# Altium project ETRX_Shield.PrjPcb (part 2 of 2)

## Sheet [2] MCU.SchDoc
size A4; DocumentNumber: 3; SheetNumber: 3; SheetTotal: 4
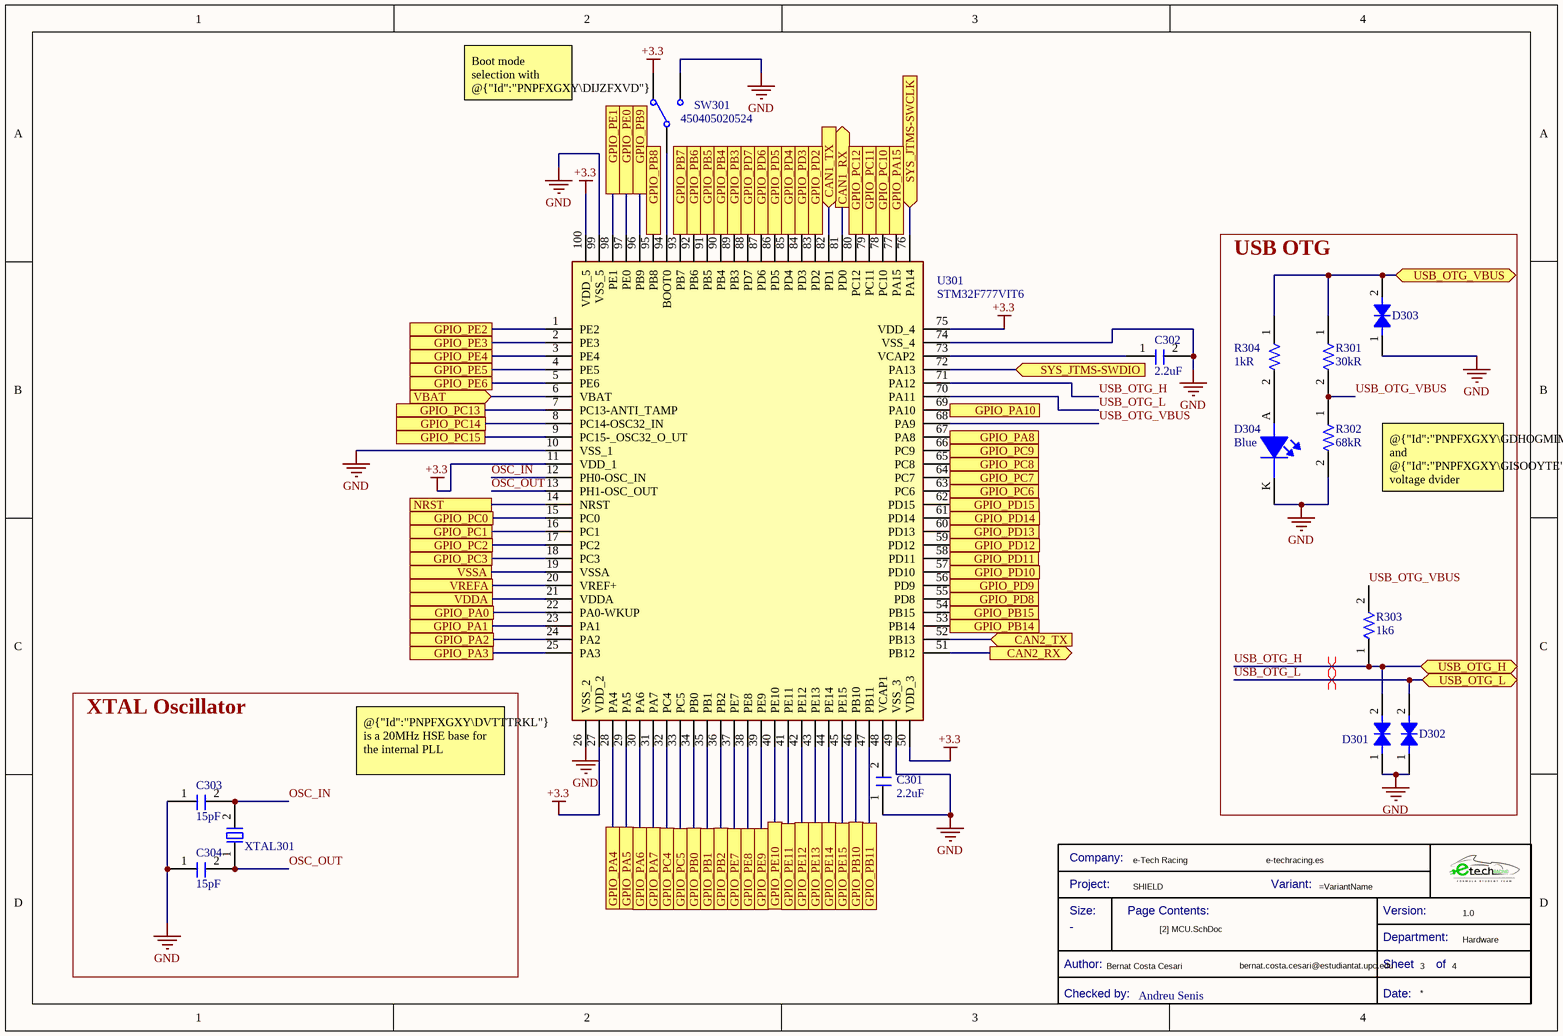
[diagram p2: [2] MCU.SchDoc]

### Parts
(Parts that share a designator on the sheet are numbered #1, #2 ... from top to bottom, then left to right.)
*?#2  Checked by:: Andreu Senis  (hidden comment: Title Block_template)  (graphical)
C301  Capacitance: 2.2uF  [C2.2u-100V-1812MLCC-X7R]  (hidden comment: HMK432B7225KM-T)
C302  Capacitance: 2.2uF  [C2.2u-100V-1812MLCC-X7R]  (hidden comment: HMK432B7225KM-T)
C303  Capacitance: 15pF  [C0805FNPC-R]  (hidden comment: 885012007052)
C304  Capacitance: 15pF  [C0805FNPC-R]  (hidden comment: 885012007052)
D301  824551301  [DTVS-DO-214AB]  (value not drawn)
D302  824551301  [DTVS-DO-214AB]  (value not drawn)
D303  824551301  [DTVS-DO-214AB]  (value not drawn)
D304  Color: Blue  [LED_0805_WE]  (hidden comment: 150080BS75000)
R301  Resistance: 30kR  [R1206FTK-W]  (hidden comment: CRCW120630K0FKEA)
R302  Resistance: 68kR  [R1206FTK-W]  (hidden comment: CR1206AFX-6802EAS)
R303  Resistance: 1k6  [R1206FTK-W]  (hidden comment: CRCW12061K60FKEA)
R304  Resistance: 1kR  [R0805FTK]  (hidden comment: CR0805-JW-102ELF)
SW301  450405020524  [450405020524]
U301  STM32F777VIT6  [QFP50P1600X1600X160-100N]
XTAL301  830028710  [XTAL20M_SMD]  (value not drawn)

### Blocks framed on the sheet
USB OTG: D301-D304 R301-R304
XTAL Oscillator: C303 C304 XTAL301

### Ports
CAN1_RX (out), CAN1_TX (in), CAN2_RX (out), CAN2_TX (in), GPIO_PA0, GPIO_PA1, GPIO_PA2, GPIO_PA3, GPIO_PA4, GPIO_PA5, GPIO_PA6, GPIO_PA7, GPIO_PA8, GPIO_PA10, GPIO_PA15, GPIO_PB0, GPIO_PB1, GPIO_PB2, GPIO_PB3, GPIO_PB4, GPIO_PB5, GPIO_PB6, GPIO_PB7, GPIO_PB8, GPIO_PB9, GPIO_PB10, GPIO_PB11, GPIO_PB14, GPIO_PB15, GPIO_PC0, GPIO_PC1, GPIO_PC2, GPIO_PC3, GPIO_PC4, GPIO_PC5, GPIO_PC6, GPIO_PC7, GPIO_PC8, GPIO_PC9, GPIO_PC10, GPIO_PC11, GPIO_PC12, GPIO_PC13, GPIO_PC14, GPIO_PC15, GPIO_PD2, GPIO_PD3, GPIO_PD4, GPIO_PD5, GPIO_PD6, GPIO_PD7, GPIO_PD8, GPIO_PD9, GPIO_PD10, GPIO_PD11, GPIO_PD12, GPIO_PD13, GPIO_PD14, GPIO_PD15, GPIO_PE0, GPIO_PE1, GPIO_PE2, GPIO_PE3, GPIO_PE4, GPIO_PE5, GPIO_PE6, GPIO_PE7, GPIO_PE8, GPIO_PE9, GPIO_PE10, GPIO_PE11, GPIO_PE12, GPIO_PE13, GPIO_PE14, GPIO_PE15, NRST, SYS_JTMS-SWCLK (in), SYS_JTMS-SWDIO (in), USB_OTG_H (bidir), USB_OTG_L (bidir), USB_OTG_VBUS (bidir), VBAT (in), VDDA, VREFA, VSSA

### Nets
+3.3: SW301.L1 U301.11(VDD_1) U301.27(VDD_2) U301.50(VDD_3) U301.75(VDD_4) U301.100(VDD_5)
GND: C301.1 C302.2 C303.1 C304.1 D301.1 D302.1 D303.1 D304.K R302.2 SW301.L2 U301.10(VSS_1) U301.26(VSS_2) U301.49(VSS_3) U301.74(VSS_4) U301.99(VSS_5)
CAN1_RX: U301.81(PD0) ; port CAN1_RX
CAN1_TX: U301.82(PD1) ; port CAN1_TX
CAN2_RX: U301.51(PB12) ; port CAN2_RX
CAN2_TX: U301.52(PB13) ; port CAN2_TX
NRST: U301.14(NRST) ; port NRST
OSC_IN: C303.2 U301.12(PH0-OSC_IN) XTAL301.2
OSC_OUT: C304.2 U301.13(PH1-OSC_OUT) XTAL301.1
PA0: U301.22(PA0-WKUP) ; port GPIO_PA0
PA1: U301.23(PA1) ; port GPIO_PA1
PA2: U301.24(PA2) ; port GPIO_PA2
PA3: U301.25(PA3) ; port GPIO_PA3
PA4: U301.28(PA4) ; port GPIO_PA4
PA5: U301.29(PA5) ; port GPIO_PA5
PA6: U301.30(PA6) ; port GPIO_PA6
PA7: U301.31(PA7) ; port GPIO_PA7
PA8: U301.67(PA8) ; port GPIO_PA8
PA10: U301.69(PA10) ; port GPIO_PA10
PA15: U301.77(PA15) ; port GPIO_PA15
PB0: U301.34(PB0) ; port GPIO_PB0
PB1: U301.35(PB1) ; port GPIO_PB1
PB2: U301.36(PB2) ; port GPIO_PB2
PB3: U301.89(PB3) ; port GPIO_PB3
PB4: U301.90(PB4) ; port GPIO_PB4
PB5: U301.91(PB5) ; port GPIO_PB5
PB6: U301.92(PB6) ; port GPIO_PB6
PB7: U301.93(PB7) ; port GPIO_PB7
PB8: U301.95(PB8) ; port GPIO_PB8
PB9: U301.96(PB9) ; port GPIO_PB9
PB10: U301.46(PB10) ; port GPIO_PB10
PB11: U301.47(PB11) ; port GPIO_PB11
PB14: U301.53(PB14) ; port GPIO_PB14
PB15: U301.54(PB15) ; port GPIO_PB15
PC0: U301.15(PC0) ; port GPIO_PC0
PC1: U301.16(PC1) ; port GPIO_PC1
PC2: U301.17(PC2) ; port GPIO_PC2
PC3: U301.18(PC3) ; port GPIO_PC3
PC4: U301.32(PC4) ; port GPIO_PC4
PC5: U301.33(PC5) ; port GPIO_PC5
PC6: U301.63(PC6) ; port GPIO_PC6
PC7: U301.64(PC7) ; port GPIO_PC7
PC8: U301.65(PC8) ; port GPIO_PC8
PC9: U301.66(PC9) ; port GPIO_PC9
PC11: U301.79(PC11) ; port GPIO_PC11
PC12: U301.80(PC12) ; port GPIO_PC12
PC13: U301.7(PC13-ANTI_TAMP) ; port GPIO_PC13
PC14: U301.8(PC14-OSC32_IN) ; port GPIO_PC14
PC15: U301.9(PC15-_OSC32_O_UT) ; port GPIO_PC15
PD2: U301.83(PD2) ; port GPIO_PD2
PD3: U301.84(PD3) ; port GPIO_PD3
PD4: U301.85(PD4) ; port GPIO_PD4
PD5: U301.86(PD5) ; port GPIO_PD5
PD6: U301.87(PD6) ; port GPIO_PD6
PD7: U301.88(PD7) ; port GPIO_PD7
PD8: U301.55(PD8) ; port GPIO_PD8
PD9: U301.56(PD9) ; port GPIO_PD9
PD10: U301.57(PD10) U301.78(PC10) ; port GPIO_PD10, port GPIO_PC10
PD11: U301.58(PD11) ; port GPIO_PD11
PD12: U301.59(PD12) ; port GPIO_PD12
PD13: U301.60(PD13) ; port GPIO_PD13
PD14: U301.61(PD14) ; port GPIO_PD14
PD15: U301.62(PD15) ; port GPIO_PD15
PE0: U301.97(PE0) ; port GPIO_PE0
PE1: U301.98(PE1) ; port GPIO_PE1
PE2: U301.1(PE2) ; port GPIO_PE2
PE3: U301.2(PE3) ; port GPIO_PE3
PE4: U301.3(PE4) ; port GPIO_PE4
PE5: U301.4(PE5) ; port GPIO_PE5
PE6: U301.5(PE6) ; port GPIO_PE6
PE7: U301.37(PE7) ; port GPIO_PE7
PE8: U301.38(PE8) ; port GPIO_PE8
PE9: U301.39(PE9) ; port GPIO_PE9
PE10: U301.40(PE10) ; port GPIO_PE10
PE11: U301.41(PE11) ; port GPIO_PE11
PE12: U301.42(PE12) ; port GPIO_PE12
PE13: U301.43(PE13) ; port GPIO_PE13
PE14: U301.44(PE14) ; port GPIO_PE14
PE15: U301.45(PE15) ; port GPIO_PE15
SYS_JTMS-SWCLK: U301.76(PA14) ; port SYS_JTMS-SWCLK
SYS_JTMS-SWDIO: U301.72(PA13) ; port SYS_JTMS-SWDIO
USB_OTG_H: D301.2 R303.1 U301.71(PA12) ; port USB_OTG_H
USB_OTG_L: D302.2 U301.70(PA11) ; port USB_OTG_L
USB_OTG_VBUS: R301.2 R302.1 R303.2 U301.68(PA9)
USB_VBUS: D303.2 R301.1 R304.1 ; port USB_OTG_VBUS
VBAT: U301.6(VBAT) ; port VBAT
VDDA: U301.21(VDDA) ; port VDDA
VREFA: U301.20(VREF+) ; port VREFA
VSSA: U301.19(VSSA) ; port VSSA
NetC301_2: C301.2 U301.48(VCAP1)
NetC302_1: C302.1 U301.73(VCAP2)
NetD304_A: D304.A R304.2
NetSW301_COM: SW301.COM U301.94(BOOT0)

### Layout directives
differential pair: USB_OTG_H, USB_OTG_L

### Notes on the sheet
- Boot mode selection with @{"Id":"PNPFXGXY\DIJZFXVD"}
- @{"Id":"PNPFXGXY\GDHOGMIM"} and @{"Id":"PNPFXGXY\GISOOYTE"} voltage dvider required to match AMR
- @{"Id":"PNPFXGXY\DVTTTRKL"} is a 20MHz HSE base for the internal PLL
- (in symbol Title Block_template) Company:; Project:; Variant:; Size:; Page Contents:; Version:; Department:; Author:; Sheet; of; Checked by:; Date:

### Library data of the parts
*?#2 = Title Block_template: Standard Title Block; .Creator: GP; Category: Title Block; .PCBcheck: GP; .SCHcheck: GP; Size: -
C301 C302 = C2.2u-100V-1812MLCC-X7R: 贴片陶瓷电容 2.2uF ±10% 100V X7R 1812; Manufacturer: Taiyo Yuden; .Creator: DO; Manufacturer Part Number: HMK432B7225KM-T; RoHS: Yes; Category: Ceramic Capacitors; Stock 1: 13000; Pricing 1: 500=0,58000, 1000=0,47500, 1500=0,47000, 2000=0,46500 (USD); Mount: Surface Mount; Case/Package: 1812; Number of Pins: 2; Case Code (Metric): 4532; Case Code (Imperial): 1812; Min Operating Temperature: -55°C; Max Operating Temperature: 125°C; Package Quantity: 1; Voltage Rating: 100V; Tolerance: 10%; Packaging: Tape and Reel; Voltage Rating (DC): 100V; Dielectric: X7R; Termination: SMD/SMT; Series: M; Construction: Flat; Resistor Type: Ceramic; Length: 4.5mm; Width: 0.126inch; Height: 2.5mm; Thickness: 0.106inch; Depth: 3.2mm; Radiation Hardening: No; RoHS Compliant: Yes; REACH SVHC: Unknown; Halogen Free: Halogen Free; ComponentLink1URL: https://datasheet.ciiva.com/142/hmk432b7225km-t-ss-142288.pdf?src-supplier=Digi-Key; ComponentLink1Description: https://datasheet.ciiva.com/142/hmk432b7225km-t-ss-142288.pdf?src-supplier=Digi-Key; ComponentLink2URL: https://datasheet.ciiva.com/26871/getdatasheetpartid-638888-26871989.pdf?src-supplier=Verical; ComponentLink2Description: https://datasheet.ciiva.com/26871/getdatasheetpartid-638888-26871989.pdf?src-supplier=Verical; ComponentLink3URL: https://datasheet.ciiva.com/30247/946hmk432b7225km-t-30247370.pdf?src-supplier=Onlinecomponents.com; ComponentLink3Description: https://datasheet.ciiva.com/30247/946hmk432b7225km-t-30247370.pdf?src-supplier=Onlinecomponents.com; ComponentLink4URL: https://datasheet.ciiva.com/28645/746258-28645086.pdf?src-supplier=Element14; ComponentLink4Description: https://datasheet.ciiva.com/28645/746258-28645086.pdf?src-supplier=Element14; ComponentLink5URL: https://datasheet.ciiva.com/15921/mlcc06-e-15921031.pdf?src-supplier=Onlinecomponents.com; ComponentLink5Description: https://datasheet.ciiva.com/15921/mlcc06-e-15921031.pdf?src-supplier=Onlinecomponents.com; Supplier Part Number 1: 9062137; Supplier 1: Future Electronics
C303 C304 = C15p-50V-0805FNPC-NP0: Cap, 15PF, 50V, 5%, C0G/NP0, 0805; Manufacturer 1: Wurth Electronics; .Creator: DR; Supplier 1: Newark; Manufacturer Part Number 1: 885012007052; RoHS: Yes; Category: Ceramic Capacitors; Stock 1: 815; Pricing 1: 1=0,10800, 10=0,05200, 25=0,05100, 50=0,04900, 100=0,04800, 250=0,04600, 500=0,04300 (USD); Mount: Surface Mount; Case/Package: 0805; Case Code (Metric): 2012; Case Code (Imperial): 0805; Min Operating Temperature: -55°C; Max Operating Temperature: 125°C; Packaging: Cut Tape; Voltage Rating: 50V; Tolerance: 5%; Length: 0.079inch; Width: 0.049inch; Thickness: 0.028inch; RoHS Compliant: Yes; ComponentLink1URL: http://www.farnell.com/datasheets/2031702.pdf?src-supplier=Farnell; ComponentLink1Description: http://www.farnell.com/datasheets/2031702.pdf?src-supplier=Farnell; ComponentLink2URL: http://katalog.we-online.de/pbs/datasheet/885012007052.pdf?src-supplier=Digi-Key; ComponentLink2Description: http://katalog.we-online.de/pbs/datasheet/885012007052.pdf?src-supplier=Digi-Key; ComponentLink3URL: https://katalog.we-online.de/pbs/datasheet/885012007052.pdf?src-supplier=Digi-Key; ComponentLink3Description: https://katalog.we-online.de/pbs/datasheet/885012007052.pdf?src-supplier=Digi-Key; Supplier Part Number 1: 15AC9316
D301-D303 = DTVS-40V-DO-214AB: TVS diode [Würth Elektronik] 824551301 TVS diode; Manufacturer: Wurth Electronics; Number of Bidirectional Channels: 1; Reverse Standoff Voltage: 30V; Min Breakdown Voltage: 35.05V; Clamping Voltage: 48.4V; Peak Pulse Power: 3kW; Power Line Protection: No; Polarity: Bidirectional; Peak Pulse Current: 62A; .Creator: DO; ComponentLink2Description: Where buy it; ComponentLink2URL: https://www.we-online.com/catalog/en/WE-TVSP?sq=824551301#824551301; Supplier 1: RSComponents; Manufacturer Part Number: 824551301; RoHS: Yes; Category: TVS Diodes; Stock 1: 1; Pricing 1: 10=1,72500, 50=1,54700, 100=1,45300, 250=1,35100, 500=1,15000 (USD); Mount: Surface Mount; Number of Pins: 2; Min Operating Temperature: -65°C; Max Operating Temperature: 150°C; Packaging: Cut Tape; Max Breakdown Voltage: 35.05V; Resistor Type: Zener; REACH SVHC: Unknown; RoHS Compliant: Yes; ComponentLink1URL: http://www.farnell.com/datasheets/2036459.pdf?src-supplier=Element14; ComponentLink1Description: http://www.farnell.com/datasheets/2036459.pdf?src-supplier=Element14; Supplier Part Number 1: 9217092P
D304 = LEDBS-0805-145: LED BLUE CLEAR 0805 SMD; Manufacturer 1: Wurth Electronics; Luminous Intensity: 145mcd; Viewing Angle: 140°; Forward Voltage: 3.2V; Wavelength: 470nm; Lens Style: Clear,Rectangular; Forward Current: 30mA; Test Current: 20mA; .Creator: GP; ComponentLink1Description: Datasheet; ComponentLink1URL: https://www.we-online.com/catalog/datasheet/150080BS75000.pdf; ComponentLink2Description: Where buy it; ComponentLink2URL: https://katalog.we-online.de/en/led/WL-SMCW/150080BS75000; Supplier 1: RSComponents; Manufacturer Part Number 1: 150080BS75000; RoHS: Yes; Category: LEDs; Stock 1: 7400; Pricing 1: 50=0,19300, 500=0,12900, 1000=0,12200, 2000=0,11700, 4000=0,11100 (USD); Mount: Surface Mount; Case/Package: 0805; Case Code (Metric): 2012; Case Code (Imperial): 0805; Min Operating Temperature: -40°C; Max Operating Temperature: 85°C; Package Quantity: 4000; Packaging: Tape and Reel; Dominant Wavelength: 470nm; Length: 2mm; Width: 1.25mm; Height: 0.7mm; REACH SVHC: Unknown; RoHS Compliant: Yes; Lead Free: Lead Free; ComponentLink3URL: https://datasheet.ciiva.com/23843/150080bs75000-23843251.pdf?src-supplier=Newark; ComponentLink3Description: https://datasheet.ciiva.com/23843/150080bs75000-23843251.pdf?src-supplier=Newark; ComponentLink4URL: https://datasheet.ciiva.com/22656/1740214-22656954.pdf?src-supplier=Element14; ComponentLink4Description: https://datasheet.ciiva.com/22656/1740214-22656954.pdf?src-supplier=Element14; ComponentLink5URL: https://datasheet.ciiva.com/29279/759433-da-01-en-chipled-0805-w-kl-blau-150080bs75000-29279203.pdf?src-supplier=Conrad; ComponentLink5Description: https://datasheet.ciiva.com/29279/759433-da-01-en-chipled-0805-w-kl-blau-150080bs75000-29279203.pdf?src-supplier=Conrad; ComponentLink6URL: https://datasheet.ciiva.com/29562/150080bs75000-29562922.pdf?src-supplier=Digi-Key; ComponentLink6Description: https://datasheet.ciiva.com/29562/150080bs75000-29562922.pdf?src-supplier=Digi-Key; ComponentLink7URL: https://datasheet.ciiva.com/29562/150080bs75000-29562923.pdf?src-supplier=Digi-Key; ComponentLink7Description: https://datasheet.ciiva.com/29562/150080bs75000-29562923.pdf?src-supplier=Digi-Key; Supplier Part Number 1: 8154228
R301 = R30k-1206FTK: Res Thick Film 1206 30K Ohm 1% 1/4W ±100ppm/°C Molded SMD SMD Paper T/R; Manufacturer: Vishay; Power Rating: 250mW; Voltage Rating: 200V; .Creator: GP; Category: Resistor; ComponentLink1Description: Datasheet; ComponentLink1URL: https://docs.rs-online.com/bca8/A700000006404581.pdf; ComponentLink2Description: Where buy it; ComponentLink2URL: https://es.rs-online.com/web/p/resistencias-de-montaje-en-superficie/6792039; Supplier 1: RSComponents; Manufacturer Part Number: CRCW120630K0FKEA; RoHS: Yes; Stock 1: 3550; Pricing 1: 50=0,12000, 500=0,11200, 1000=0,10400, 2000=0,09700, 4000=0,08900 (USD); Case/Package: 1206; Number of Pins: 2; Contact Plating: Tin; Case Code (Imperial): 1206; Case Code (Metric): 3216; Weight: 0.000353oz; Size Code: 1206; Min Operating Temperature: -55°C; Max Operating Temperature: 155°C; Tolerance: 1%; Resistor Type: Thick Film; Packaging: Tape and Reel; Temperature Coefficient: 100ppm/°C; Package Quantity: 10; Termination: SMD/SMT; Number of Terminations: 2; Max Power Dissipation: 250mW; Features: Automotive AEC-Q200; Series: CRCW; Construction: Rectangular; Resistance Tolerance: 1%; Technology: THICK FILM; Length: 3.2mm; Width: 1.6mm; Height: 0.55mm; Depth: 1.6mm; Radiation Hardening: No; RoHS Compliant: Yes; REACH SVHC: Unknown; Military Standard: Not; Supplier Part Number 1: 6792039
R302 = R68k-1206FTK: Resistor, AS 1206 68k1% 250mW TC100; Manufacturer: Bourns; .Creator: DO; Supplier 1: Newark; Manufacturer Part Number: CR1206AFX-6802EAS; RoHS: Yes; Category: Chip SMD Resistors; Stock 1: 4700; Pricing 1: 1=0,01100, 25=0,01100, 50=0,01100, 100=0,01100, 250=0,01100, 500=0,01100 (USD); Supplier Part Number 1: 16AH0632; ComponentLink1Description: Where buy it; ComponentLink1URL: https://www.mouser.es/ProductDetail/Bourns/CR1206AFX-6802EAS?qs=PzGy0jfpSMtMA5jyzS7M7w%3D%3D; ComponentLink2Description: Datasheet; ComponentLink2URL: https://www.mouser.es/datasheet/2/54/cr_a_as-1858644.pdf
R303 = R1.6K-1206FTK: Res Thick Film 1206 1.6K Ohm 1% 1/4W ±100ppm/°C Molded SMD SMD Paper T/R; Manufacturer 1: Vishay; Max Power Dissipation: 250mW; Voltage Rating: 200V; .Creator: DO; Supplier 1: Digi-Key; Manufacturer Part Number 1: CRCW12061K60FKEA; RoHS: Yes; Category: Chip SMD Resistors; Pricing 1: 1=0,10000, 10=0,08200, 100=0,03160, 1000=0,01392, 2500=0,01202 (USD); Case/Package: 1206; Number of Pins: 2; Contact Plating: Tin; Case Code (Metric): 3216; Case Code (Imperial): 1206; Weight: 0.000353oz; Size Code: 1206; Min Operating Temperature: -55°C; Max Operating Temperature: 155°C; Tolerance: 1%; Resistor Type: Thick Film; Temperature Coefficient: 100ppm/°C; Package Quantity: 5000; Packaging: Tape and Reel; Number of Terminations: 2; Features: Automotive AEC-Q200; Series: CRCW; Power Rating: 250mW; Termination: SMD/SMT; Voltage Rating (DC): 200V; Resistance Tolerance: 1%; Technology: THICK FILM; Construction: Rectangular; Length: 3.2mm; Width: 0.063inch; Height: 0.55mm; Depth: 1.6mm; Radiation Hardening: No; Lead Free: Lead Free; RoHS Compliant: Yes; REACH SVHC: Unknown; Military Standard: Not; ComponentLink1URL: https://datasheet.ciiva.com/11811/0900766b80d98b5e-11811377.pdf?src-supplier=RSComponents; ComponentLink1Description: https://datasheet.ciiva.com/11811/0900766b80d98b5e-11811377.pdf?src-supplier=RSComponents; ComponentLink2URL: https://datasheet.ciiva.com/2515/dcrcwe3-2515616.pdf?src-supplier=Digi-Key; ComponentLink2Description: https://datasheet.ciiva.com/2515/dcrcwe3-2515616.pdf?src-supplier=Digi-Key; ComponentLink3URL: https://datasheet.ciiva.com/2515/dcrcwe3-2515617.pdf?src-supplier=Digi-Key; ComponentLink3Description: https://datasheet.ciiva.com/2515/dcrcwe3-2515617.pdf?src-supplier=Digi-Key; ComponentLink4URL: https://datasheet.ciiva.com/2515/dcrcwe3-2515618.pdf?src-supplier=Digi-Key; ComponentLink4Description: https://datasheet.ciiva.com/2515/dcrcwe3-2515618.pdf?src-supplier=Digi-Key; ComponentLink5URL: https://datasheet.ciiva.com/9098/dcrcwe3-9098889.pdf?src-supplier=Avnet; ComponentLink5Description: https://datasheet.ciiva.com/9098/dcrcwe3-9098889.pdf?src-supplier=Avnet; ComponentLink6URL: https://datasheet.ciiva.com/16213/dcrcwe3-16213498.pdf?src-supplier=Future+Electronics; ComponentLink6Description: https://datasheet.ciiva.com/16213/dcrcwe3-16213498.pdf?src-supplier=Future+Electronics; ComponentLink7URL: https://datasheet.ciiva.com/17203/dcrcwe3-17203786.pdf?src-supplier=Avnet+Europe; ComponentLink7Description: https://datasheet.ciiva.com/17203/dcrcwe3-17203786.pdf?src-supplier=Avnet+Europe; ComponentLink8URL: https://datasheet.ciiva.com/7670/1697337-7670316.pdf?src-supplier=Element14; ComponentLink8Description: https://datasheet.ciiva.com/7670/1697337-7670316.pdf?src-supplier=Element14; ComponentLink9URL: https://datasheet.ciiva.com/7670/1697337-7670317.pdf?src-supplier=Element14; ComponentLink9Description: https://datasheet.ciiva.com/7670/1697337-7670317.pdf?src-supplier=Element14; ComponentLink10URL: https://datasheet.ciiva.com/5550/dcrcwe3-109170-5550718.pdf?src-supplier=Mouser; ComponentLink10Description: https://datasheet.ciiva.com/5550/dcrcwe3-109170-5550718.pdf?src-supplier=Mouser; Supplier Part Number 1: 541-1.60KFCT-ND; ComponentLink11Description: RS; ComponentLink11URL: https://es.rs-online.com/web/p/resistencias-fijas-para-montaje-en-superficie/6791866/
R304 = R1k-0805FTK: Res Thick Film 0805 1K Ohm 5% 1/8W ±200ppm/°C Molded SMD SMD Paper Tape on Plastic Reel; Manufacturer 1: Bourns; Voltage Rating (DC): 150V; Power Rating: 125mW; .Creator: GP; Supplier 1: Arrow Electronics; Manufacturer Part Number 1: CR0805-JW-102ELF; RoHS: Yes; Category: Chip SMD Resistors; Stock 1: 27510; Pricing 1: 1=0,05930, 10=0,03510, 25=0,01790, 100=0,00800, 250=0,00790, 500=0,00590, 1000=0,00360, 3000=0,00350, 6000=0,00250 (USD); Mount: Surface Mount; Case/Package: 0805; Number of Pins: 2; Contact Plating: Tin; Case Code (Metric): 2012; Case Code (Imperial): 0805; Min Operating Temperature: -55°C; Max Operating Temperature: 155°C; Resistor Type: Thick Film; Tolerance: 5%; Temperature Coefficient: 200ppm/°C; Features: Moisture Resistant; Package Quantity: 1; Packaging: Tape and Reel; Voltage Rating: 150V; Number of Terminations: 2; Termination: SMD/SMT; Max Power Dissipation: 125mW; Length: 2mm; Width: 1.25mm; Height: 0.5mm; Thickness: 508um; Depth: 1.25mm; Radiation Hardening: No; Lead Free: Lead Free; REACH SVHC: No SVHC; Military Standard: Not; ComponentLink1URL: https://datasheet.ciiva.com/11821/0900766b80fcdb72-11821134.pdf?src-supplier=RSComponents; ComponentLink1Description: https://datasheet.ciiva.com/11821/0900766b80fcdb72-11821134.pdf?src-supplier=RSComponents; ComponentLink2URL: https://datasheet.ciiva.com/15225/getdatasheetpartid-78155-15225381.pdf?src-supplier=Verical; ComponentLink2Description: https://datasheet.ciiva.com/15225/getdatasheetpartid-78155-15225381.pdf?src-supplier=Verical; ComponentLink3URL: https://datasheet.ciiva.com/22693/1902866-22693253.pdf?src-supplier=Element14; ComponentLink3Description: https://datasheet.ciiva.com/22693/1902866-22693253.pdf?src-supplier=Element14; ComponentLink4URL: https://datasheet.ciiva.com/7986/1856384-7986184.pdf?src-supplier=Element14; ComponentLink4Description: https://datasheet.ciiva.com/7986/1856384-7986184.pdf?src-supplier=Element14; ComponentLink5URL: https://datasheet.ciiva.com/7985/1856384-7985867.pdf?src-supplier=Element14; ComponentLink5Description: https://datasheet.ciiva.com/7985/1856384-7985867.pdf?src-supplier=Element14; ComponentLink6URL: https://datasheet.ciiva.com/30242/159chpreztr-30242765.pdf?src-supplier=Onlinecomponents.com; ComponentLink6Description: https://datasheet.ciiva.com/30242/159chpreztr-30242765.pdf?src-supplier=Onlinecomponents.com; ComponentLink7URL: https://datasheet.ciiva.com/6547/chpreztr-6547359.pdf?src-supplier=Digi-Key; ComponentLink7Description: https://datasheet.ciiva.com/6547/chpreztr-6547359.pdf?src-supplier=Digi-Key; Supplier Part Number 1: CR0805-JW-102ELF
SW301 = 450405020524: WS-SLSU SMT Mini Slide Switch Same Side Connection, SPDT, 5VDC, 300mA, 225g; Manufacturer: Wurth Elektronik; ComponentLink1Description: Website Link; ComponentLink1URL: https://www.we-online.com/redexpert/article/450405020524?ad; ComponentLink2Description: Datasheet Link; ComponentLink2URL: https://www.we-online.com/redexpert/spec/450405020524?ad; Manufacturer Part Number: 450405020524; Category: Slide Switches; Match Code: WS-SLSU; Mount: Surface Mount; Operating Temperature Max: 85°C; Operating Temperature Min: -40°C; Packaging: Tape and Reel; Length: 8.7mm; Width: 3mm; Height: 2mm; Circuit: SPDT; Contact Material: Copper Alloy; Contact Plating: Silver; Operation Force: 225g; Rated Current: 300mA; Rated Voltage: 5VDC; Terminal Material: Copper Alloy; Terminal Plating: Silver
U301 = STM32F777VIT6: ARM Microcontrollers - MCU 16/32-BITS MICROS; Manufacturer_Name: STMicroelectronics; Geometry.Height: 1.6mm; Mouser Part Number: 511-STM32F777VIT6; Mouser Price/Stock: https://www.mouser.co.uk/ProductDetail/STMicroelectronics/STM32F777VIT6?qs=qzCNEk%252BRr%252BbclRoyC9pexg%3D%3D; Manufacturer_Part_Number: STM32F777VIT6; Datasheet Link: https://www.st.com/resource/en/datasheet/stm32f777vi.pdf
XTAL301 = XTAL20M_SMD: 830028710, 20 MHz; Manufacturer: Würth Elektronik; Frequency: 20 MHz; Frequency Stability: +-50 ppm; Drive level: 500µW max; .Creator: GP; Category: XTAL; ComponentLink1Description: Datasheet; ComponentLink1URL: https://www.we-online.com/catalog/datasheet/830028710.pdf; ComponentLink2Description: Where buy it; Package: *; Manufacturer part number: 830028710; Supplier: Würth Elektronik; Packaging: Reel; Max operating temperature.: 85ºC; Min operating temperature: -40ºC; Max power dissipation: *; Power rating: *; RoHS: Yes; Number of pins: 2; Type: SMD; Supplier 1: Digi-Key; Stock 1: 975; Pricing 1: 1=0,37000, 10=0,28100, 50=0,26800, 100=0,24400, 500=0,22000 (USD); Supplier Part Number 1: 1923-830028710CT-ND

## Sheet [3] CAN.SchDoc
size A4; DocumentNumber: 4; SheetNumber: 4; SheetTotal: 4
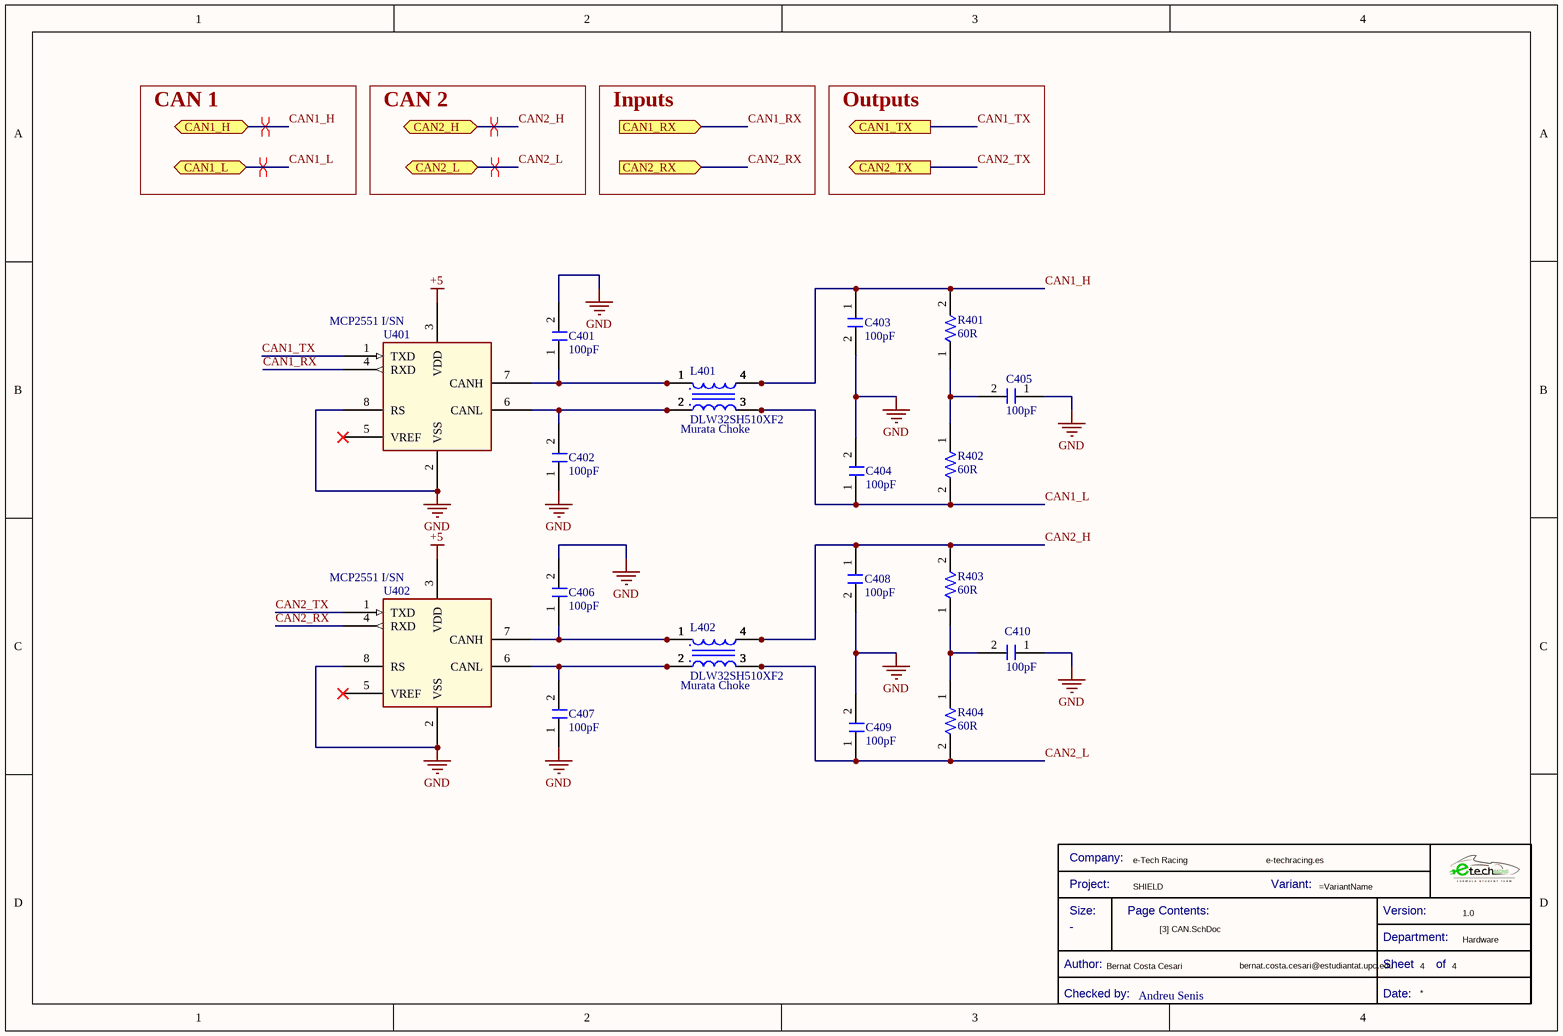
[diagram p3: [3] CAN.SchDoc]

### Parts
(Parts that share a designator on the sheet are numbered #1, #2 ... from top to bottom, then left to right.)
*?#3  Checked by:: Andreu Senis  (hidden comment: Title Block_template)  (graphical)
C401  Capacitance: 100pF  [C0805FNPC-W]  (hidden comment: 885012007057)
C402  Capacitance: 100pF  [C0805FNPC-W]  (hidden comment: 885012007057)
C403  Capacitance: 100pF  [C0805FNPC-W]  (hidden comment: 885012007057)
C404  Capacitance: 100pF  [C0805FNPC-W]  (hidden comment: 885012007057)
C405  Capacitance: 100pF  [C0805FNPC-W]  (hidden comment: 885012007057)
C406  Capacitance: 100pF  [C0805FNPC-W]  (hidden comment: 885012007057)
C407  Capacitance: 100pF  [C0805FNPC-W]  (hidden comment: 885012007057)
C408  Capacitance: 100pF  [C0805FNPC-W]  (hidden comment: 885012007057)
C409  Capacitance: 100pF  [C0805FNPC-W]  (hidden comment: 885012007057)
C410  Capacitance: 100pF  [C0805FNPC-W]  (hidden comment: 885012007057)
L401  DLW32SH510XF2
L402  DLW32SH510XF2
R401  value 60R  [R0805FTK]  (hidden comment: R60-0805FTN)
R402  value 60R  [R0805FTK]  (hidden comment: R60-0805FTN)
R403  value 60R  [R0805FTK]  (hidden comment: R60-0805FTN)
R404  value 60R  [R0805FTK]  (hidden comment: R60-0805FTN)
U401  MCP2551 I/SN
U402  MCP2551 I/SN

### Ports
CAN1_H (bidir), CAN1_L (bidir), CAN1_RX (in), CAN1_TX (out), CAN2_H (bidir), CAN2_L (bidir), CAN2_RX (in), CAN2_TX (out)

### Nets
+5: U401.3(VDD) U402.3(VDD)
GND: C401.2 C402.1 C403.2 C404.2 C405.1 C406.2 C407.1 C408.2 C409.2 C410.1 U401.2(VSS) U401.8(RS) U402.2(VSS) U402.8(RS)
CAN1_H: C403.1 L401.4(4_OUT) R401.2 ; port CAN1_H
CAN1_L: C404.1 L401.3(3_OUT) R402.2 ; port CAN1_L
CAN1_RX: U401.4(RXD) ; port CAN1_RX
CAN1_TX: U401.1(TXD) ; port CAN1_TX
CAN2_H: C408.1 L402.4(4_OUT) R403.2 ; port CAN2_H
CAN2_L: C409.1 L402.3(3_OUT) R404.2 ; port CAN2_L
CAN2_RX: U402.4(RXD) ; port CAN2_RX
CAN2_TX: U402.1(TXD) ; port CAN2_TX
NetC401_1: C401.1 L401.1(1_IN) U401.7(CANH)
NetC402_2: C402.2 L401.2(2_IN) U401.6(CANL)
NetC405_2: C405.2 R401.1 R402.1
NetC406_1: C406.1 L402.1(1_IN) U402.7(CANH)
NetC407_2: C407.2 L402.2(2_IN) U402.6(CANL)
NetC410_2: C410.2 R403.1 R404.1

Not connected (* = marked no-connect by the designer): U401 5(VREF)*; U402 5(VREF)*

### Layout directives
differential pair: CAN1_H, CAN1_L, CAN2_H, CAN2_L

### Notes on the sheet
- CAN 1
- CAN 2
- Inputs
- Outputs
- (near L401) Murata Choke
- (near L402) Murata Choke
- (in symbol Title Block_template) Company:; Project:; Variant:; Size:; Page Contents:; Version:; Department:; Author:; Sheet; of; Checked by:; Date:

### Library data of the parts
*?#3 = Title Block_template: Standard Title Block; .Creator: GP; Category: Title Block; .PCBcheck: GP; .SCHcheck: GP; Size: -
C401-C410 = C100p-50V-0805FNPC-C0G/NP0: Multilayer Ceramic Capacitor, Wcap-Csgp Series, 100 Pf, 5%, C0G / Np0, 50 V, 0805 [2012 Metric] Rohs Compliant: Yes; Manufacturer: Wurth Electronics; Voltage Rating: 50V; .Creator: DR; Supplier 1: RSComponents; Manufacturer Part Number: 885012007057; RoHS: Yes; Category: Ceramic Capacitors; Stock 1: 1; Pricing 1: 4000=0,03900, 12000=0,03800 (USD); Mount: Surface Mount; Case/Package: 0805; Case Code (Metric): 2012; Case Code (Imperial): 0805; Min Operating Temperature: -55°C; Max Operating Temperature: 125°C; Packaging: Cut Tape; Dielectric: C0G; Tolerance: 5%; Voltage Rating (DC): 50V; Length: 0.079inch; Width: 0.049inch; Thickness: 0.035inch; REACH SVHC: Unknown; RoHS Compliant: Yes; ComponentLink1URL: http://www.farnell.com/datasheets/1958443.pdf?src-supplier=Farnell; ComponentLink1Description: http://www.farnell.com/datasheets/1958443.pdf?src-supplier=Farnell; ComponentLink2URL: https://katalog.we-online.de/pbs/datasheet/885012007057.pdf?src-supplier=Digi-Key; ComponentLink2Description: https://katalog.we-online.de/pbs/datasheet/885012007057.pdf?src-supplier=Digi-Key; ComponentLink3URL: http://www.farnell.com/datasheets/1958443.pdf?src-supplier=Element14; ComponentLink3Description: http://www.farnell.com/datasheets/1958443.pdf?src-supplier=Element14; ComponentLink4URL: http://www.farnell.com/datasheets/1958443.pdf?src-supplier=Newark; ComponentLink4Description: http://www.farnell.com/datasheets/1958443.pdf?src-supplier=Newark; ComponentLink5Description: Where buy it; ComponentLink5URL: https://www.we-online.com/catalog/en/WCAP-CSGP-50VDC#885012007057; Supplier Part Number 1: 1813930
L401 L402 = Choke Murata
R401-R404 = R60-0805FTN: Res Thin Film 0805 60.4 Ohm 0.1% 1/8W ±25ppm/°C Molded SMD SMD Punched Carrier T/R; Manufacturer 1: Panasonic; Manufacturer Part Number 1: ERA-6AEB60R4V; Resistance: 60.4R; Voltage Rating (DC): 100V; Max Power Dissipation: 125mW; Voltage Rating: 200V; .Creator: DR; Supplier 1: Arrow Electronics; RoHS: Yes; Category: Chip SMD Resistors; Stock 1: 5000; Pricing 1: 1=0,04650, 10=0,03900, 100=0,02860 (USD); Mount: Surface Mount; Case/Package: 0805; Number of Pins: 2; Contact Plating: Tin; Weight: 0.000194oz; Case Code (Metric): 2012; Case Code (Imperial): 0805; Min Operating Temperature: -55°C; Max Operating Temperature: 155°C; Temperature Coefficient: 25ppm/°C; Tolerance: 0.1%; Resistor Type: Thin Film,Metal Film; Features: Automotive AEC-Q200; Package Quantity: 5000; Number of Terminations: 2; Termination: SMD/SMT; Power Rating: 125mW; Packaging: Tape and Reel; Length: 2mm; Width: 1.25mm; Height: 0.5mm; Depth: 1.25mm; Radiation Hardening: No; Lead Free: Lead Free; ComponentLink1URL: https://datasheet.ciiva.com/11811/0900766b80eb1d8c-11811180.pdf?src-supplier=RSComponents; ComponentLink1Description: https://datasheet.ciiva.com/11811/0900766b80eb1d8c-11811180.pdf?src-supplier=RSComponents; ComponentLink2URL: https://datasheet.ciiva.com/41450/001181146-da-01-en-widerstand-era-0805-60r4-0-1-5000st-41450303.pdf?src-supplier=Conrad; ComponentLink2Description: https://datasheet.ciiva.com/41450/001181146-da-01-en-widerstand-era-0805-60r4-0-1-5000st-41450303.pdf?src-supplier=Conrad; ComponentLink3URL: https://datasheet.ciiva.com/5951/485442-5951173.pdf?src-supplier=Farnell; ComponentLink3Description: https://datasheet.ciiva.com/5951/485442-5951173.pdf?src-supplier=Farnell; ComponentLink4URL: https://datasheet.ciiva.com/30184/54aoa0000ce26-30184022.pdf?src-supplier=Onlinecomponents.com; ComponentLink4Description: https://datasheet.ciiva.com/30184/54aoa0000ce26-30184022.pdf?src-supplier=Onlinecomponents.com; ComponentLink5URL: https://datasheet.ciiva.com/9188/aoa0000ce26-9188476.pdf?src-supplier=Avnet; ComponentLink5Description: https://datasheet.ciiva.com/9188/aoa0000ce26-9188476.pdf?src-supplier=Avnet; Supplier Part Number 1: ERA-6AEB60R4V
U401 U402 = Transceiver CAN MCP2551 I/SN

## Nets that join several sheets
+3.3: ETRX_Shield (6 pins), [1] Supply (C202.2 R202.1 U201.2 U201.4), [2] MCU (6 pins)
+5: ETRX_Shield (J104.27 J105.27 J106.27 J107.27), [1] Supply (C201.1 DCDC201.3 R201.1 U201.3), [3] CAN (U401.3 U402.3)
GND: ETRX_Shield (12 pins), [1] Supply (7 pins), [2] MCU (15 pins), [3] CAN (14 pins)
LV+ in: ETRX_Shield (J101.1 J104.2 R101.1), [1] Supply (D201.2 D202.A)
CAN1_H: ETRX_Shield (J101.2), [3] CAN (C403.1 L401.4 R401.2)
CAN1_L: ETRX_Shield (J101.3), [3] CAN (C404.1 L401.3 R402.2)
CAN1_RX: [2] MCU (U301.81), [3] CAN (U401.4)
CAN1_TX: [2] MCU (U301.82), [3] CAN (U401.1)
CAN2_H: ETRX_Shield (J101.4), [3] CAN (C408.1 L402.4 R403.2)
CAN2_L: ETRX_Shield (J101.5), [3] CAN (C409.1 L402.3 R404.2)
CAN2_RX: [2] MCU (U301.51), [3] CAN (U402.4)
CAN2_TX: [2] MCU (U301.52), [3] CAN (U402.1)
NRST: ETRX_Shield (J103.5 SW101.A1), [2] MCU (U301.14)
PA0: ETRX_Shield (J104.9), [2] MCU (U301.22)
PA1: ETRX_Shield (J104.11), [2] MCU (U301.23)
PA2: ETRX_Shield (J104.13), [2] MCU (U301.24)
PA3: ETRX_Shield (J104.15), [2] MCU (U301.25)
PA4: ETRX_Shield (J104.17), [2] MCU (U301.28)
PA5: ETRX_Shield (J104.19), [2] MCU (U301.29)
PA6: ETRX_Shield (J104.21), [2] MCU (U301.30)
PA7: ETRX_Shield (J104.23), [2] MCU (U301.31)
PA8: ETRX_Shield (J106.6), [2] MCU (U301.67)
PA10: ETRX_Shield (J106.2), [2] MCU (U301.69)
PA15: ETRX_Shield (J107.25), [2] MCU (U301.77)
PB0: ETRX_Shield (J105.6), [2] MCU (U301.34)
PB1: ETRX_Shield (J105.8), [2] MCU (U301.35)
PB2: ETRX_Shield (J105.10), [2] MCU (U301.36)
PB3: ETRX_Shield (J107.18 J108.1), [2] MCU (U301.89)
PB4: ETRX_Shield (J107.16), [2] MCU (U301.90)
PB5: ETRX_Shield (J107.14), [2] MCU (U301.91)
PB6: ETRX_Shield (J107.12), [2] MCU (U301.92)
PB7: ETRX_Shield (J107.10), [2] MCU (U301.93)
PB8: ETRX_Shield (J107.8), [2] MCU (U301.95)
PB9: ETRX_Shield (J107.6), [2] MCU (U301.96)
PB10: ETRX_Shield (J105.23), [2] MCU (U301.46)
PB11: ETRX_Shield (J105.25), [2] MCU (U301.47)
PB14: ETRX_Shield (J106.21), [2] MCU (U301.53)
PB15: ETRX_Shield (J106.19), [2] MCU (U301.54)
PC0: ETRX_Shield (J104.20), [2] MCU (U301.15)
PC1: ETRX_Shield (J104.22), [2] MCU (U301.16)
PC2: ETRX_Shield (J104.24), [2] MCU (U301.17)
PC3: ETRX_Shield (J104.26), [2] MCU (U301.18)
PC4: ETRX_Shield (J105.2), [2] MCU (U301.32)
PC5: ETRX_Shield (J105.4), [2] MCU (U301.33)
PC6: ETRX_Shield (J106.14), [2] MCU (U301.63)
PC7: ETRX_Shield (J106.12), [2] MCU (U301.64)
PC8: ETRX_Shield (J106.10), [2] MCU (U301.65)
PC9: ETRX_Shield (J106.8), [2] MCU (U301.66)
PC11: ETRX_Shield (J107.22), [2] MCU (U301.79)
PC12: ETRX_Shield (J107.20), [2] MCU (U301.80)
PC13: ETRX_Shield (J104.14), [2] MCU (U301.7)
PC14: ETRX_Shield (J104.16), [2] MCU (U301.8)
PC15: ETRX_Shield (J104.18), [2] MCU (U301.9)
PD2: ETRX_Shield (J107.13), [2] MCU (U301.83)
PD3: ETRX_Shield (J107.11), [2] MCU (U301.84)
PD4: ETRX_Shield (J107.9), [2] MCU (U301.85)
PD5: ETRX_Shield (J107.7), [2] MCU (U301.86)
PD6: ETRX_Shield (J107.5), [2] MCU (U301.87)
PD7: ETRX_Shield (J107.3), [2] MCU (U301.88)
PD8: ETRX_Shield (J106.17), [2] MCU (U301.55)
PD9: ETRX_Shield (J106.15), [2] MCU (U301.56)
PD10: ETRX_Shield (J106.13), [2] MCU (U301.57 U301.78)
PD11: ETRX_Shield (J106.11), [2] MCU (U301.58)
PD12: ETRX_Shield (U101.2), [2] MCU (U301.59)
PD13: ETRX_Shield (U101.3), [2] MCU (U301.60)
PD14: ETRX_Shield (J106.5), [2] MCU (U301.61)
PD15: ETRX_Shield (J106.3), [2] MCU (U301.62)
PE0: ETRX_Shield (J107.4), [2] MCU (U301.97)
PE1: ETRX_Shield (J107.2), [2] MCU (U301.98)
PE2: ETRX_Shield (J104.4), [2] MCU (U301.1)
PE3: ETRX_Shield (J104.6), [2] MCU (U301.2)
PE4: ETRX_Shield (J104.8), [2] MCU (U301.3)
PE5: ETRX_Shield (J104.10), [2] MCU (U301.4)
PE6: ETRX_Shield (J104.12), [2] MCU (U301.5)
PE7: ETRX_Shield (J105.12), [2] MCU (U301.37)
PE8: ETRX_Shield (J105.14), [2] MCU (U301.38)
PE9: ETRX_Shield (J105.16), [2] MCU (U301.39)
PE10: ETRX_Shield (J105.18), [2] MCU (U301.40)
PE11: ETRX_Shield (J105.20), [2] MCU (U301.41)
PE12: ETRX_Shield (J105.22), [2] MCU (U301.42)
PE13: ETRX_Shield (J105.24), [2] MCU (U301.43)
PE14: ETRX_Shield (J105.26), [2] MCU (U301.44)
SYS_JTMS-SWCLK: ETRX_Shield (J103.2), [2] MCU (U301.76)
SYS_JTMS-SWDIO: ETRX_Shield (J103.4), [2] MCU (U301.72)
USB_OTG_H: ETRX_Shield (J102.3), [2] MCU (D301.2 R303.1 U301.71)
USB_OTG_L: ETRX_Shield (J102.2), [2] MCU (D302.2 U301.70)
USB_VBUS: ETRX_Shield (J102.1), [2] MCU (D303.2 R301.1 R304.1)
VBAT: ETRX_Shield (R101.2 R102.1), [2] MCU (U301.6)
VDDA: ETRX_Shield (J104.3), [2] MCU (U301.21)
VREFA: ETRX_Shield (J104.7), [2] MCU (U301.20)
VSSA: ETRX_Shield (J104.5), [2] MCU (U301.19)